# EAGLE schematic tetris_mega_5 (EAGLE 6.2)
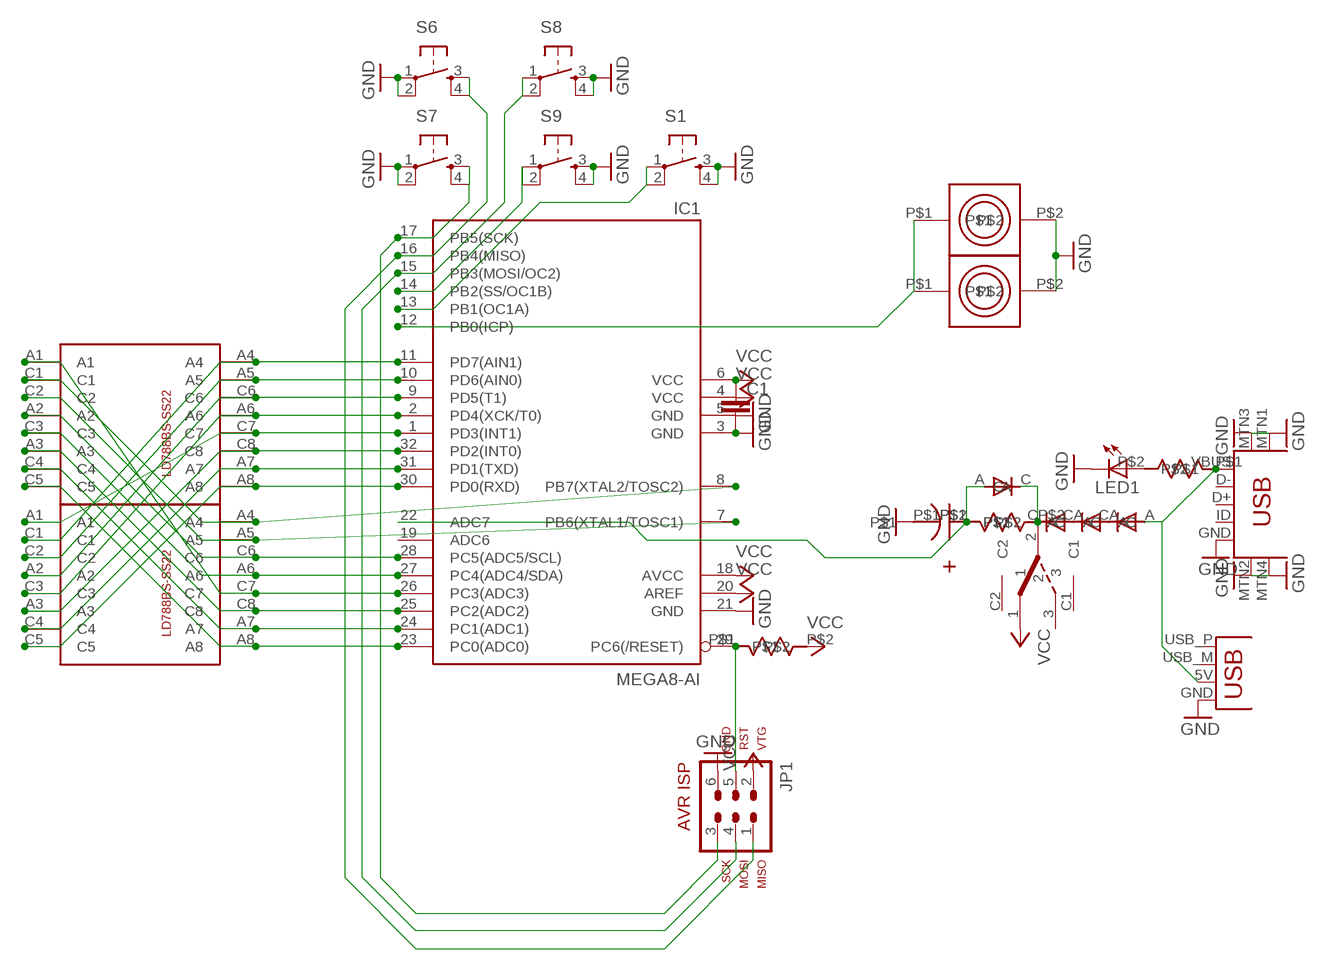
[diagram p0: schematic, sheet 1]

## Parts
C1  CAPPTH  [CAP-PTH-SMALL]
IC1  MEGA8-AI  [TQFP32-08]
JP1  AVR-ISP-6R  [AVR-ISP-6R]
LED1  LED3MM  [LED3MM]
S1  TAC_SWITCHPTH  [TACTILE-PTH]
S6  TAC_SWITCHPTH  [TACTILE-PTH]
S7  TAC_SWITCHPTH  [TACTILE-PTH]
S8  TAC_SWITCHPTH  [TACTILE-PTH]
S9  TAC_SWITCHPTH  [TACTILE-PTH]
U$1  LD788BS-SS22  [LD788BS-SS22]
U$2  LD788BS-SS22  [LD788BS-SS22]
U$3  PIEZO_ROUND_PTH  [PIEZO_ROUND_ENCASED_PTH]
U$4  I-80450RF  [ISK4.1K_I-80450RF_I2G]
U$5  USB-MINIB-5PIN  [USB-MINIB]
U$6  NICHICON_12F  [NICHICON_10X30]
U$7  R-6  [R-6]
U$8  D-6  [D-7.5]
U$9  D-6  [D-7.5]
U$10  D-6  [D-7.5]
U$11  R-6  [R-6]
U$12  D-6  [D-7.5]
U$15  SPST_PTH  [SWITCH2]
U$17  R-6  [R-6]
X1  USBPCB  [USB-A-PCB]

## Nets
GND: C1.2 IC1.3(GND) IC1.5(GND) IC1.21(GND) JP1.6 LED1.K(C) S1.3 S1.4 S6.1 S6.2 S7.1 S7.2 S8.3 S8.4 S9.3 S9.4 U$3.P$2 U$4.P$2 U$5.GND U$5.MTN1(MTN2) U$5.MTN2(MTN3) U$5.MTN3(MTN1) U$5.MTN4 U$6.P$1 X1.GND
N$1: IC1.23(PC0(ADC0)) U$1.A8 U$2.C5
N$2: IC1.24(PC1(ADC1)) U$1.A7 U$2.C4
N$3: IC1.25(PC2(ADC2)) U$1.C8 U$2.A3
N$4: IC1.30(PD0(RXD)) U$1.C5 U$2.A8
N$5: IC1.31(PD1(TXD)) U$1.C4 U$2.A7
N$6: IC1.32(PD2(INT0)) U$1.A3 U$2.C8
N$7: IC1.8(PB7(XTAL2/TOSC2)) U$1.A4 U$2.C1
N$8: IC1.7(PB6(XTAL1/TOSC1)) U$1.A5 U$2.C2
N$9: IC1.28(PC5(ADC5/SCL)) U$1.C6 U$2.A2
N$10: IC1.27(PC4(ADC4/SDA)) U$1.A6 U$2.C3
N$11: IC1.11(PD7(AIN1)) U$1.C1 U$2.A4
N$12: IC1.10(PD6(AIN0)) U$1.C2 U$2.A5
N$13: IC1.9(PD5(T1)) U$1.A2 U$2.C6
N$14: IC1.2(PD4(XCK/T0)) U$1.C3 U$2.A6
N$15: IC1.1(PD3(INT1)) U$1.A1 U$2.C7
N$16: IC1.26(PC3(ADC3)) U$1.C7 U$2.A1
N$17: IC1.29(PC6(/RESET)) JP1.5 U$7.P$1
N$19: U$8.C U$9.A
N$20: U$9.C U$10.A
N$21: IC1.17(PB5(SCK)) JP1.3
N$22: IC1.14(PB2(SS/OC1B))
N$23: IC1.16(PB4(MISO)) JP1.1 S6.3 S6.4
N$24: U$5.VBUS U$8.A U$17.P$1 X1.5V(VBUS)
N$25: S9.1 S9.2
N$26: S7.3 S7.4
N$27: IC1.13(PB1(OC1A)) S1.1 S1.2
N$28: IC1.12(PB0(ICP)) U$3.P$1 U$4.P$1
N$30: U$10.C U$11.P$2 U$12.C U$15.2
N$31: IC1.22(ADC7) U$6.P$2 U$11.P$1 U$12.A
N$34: LED1.A U$17.P$2
N$35: IC1.15(PB3(MOSI/OC2)) JP1.4 S8.1 S8.2
VCC: C1.1 IC1.4(VCC) IC1.6(VCC) IC1.18(AVCC) IC1.20(AREF) JP1.2 U$7.P$2 U$15.1
Unconnected: IC1.19(ADC6) U$5.D+ U$5.D- U$5.ID U$15.3 U$15.C1 U$15.C2 X1.USB_M(D-) X1.USB_P(D+)

## Library data of the parts
C1 = SparkFun:CAP: Capacitor Standard 0603 ceramic capacitor, and 0.1" leaded capacitor.
IC1 = atmel:MEGA8: MICROCONTROLLER 8 Kbytes FLASH, 1 kbytes SRAM, 512 bytes EEPROM, USART, 6-channel 10 bit ADC, 2-channel 8 bit ADC Pin compatible with Atmega48, ATMega88, ATMega168 Source: avr.lbr
JP1 = avr-5-4.16:AVR-ISP-6: AVR ISP-6 Serial Programming Header
LED1 = led:LED: LED OSRAM: - CHIPLED LG R971, LG N971, LY N971, LG Q971, LY Q971, LO R971, LY R971 LH N974, LH R974 LS Q976, LO Q976, LY Q976 LO Q996 - Hyper CHIPLED LW Q18S LB Q993, LB Q99A, LB R99A - SideLED LS A670, LO A670, LY A670, LG A670, LP A670 LB A673, LV A673, LT A673, LW A673 LH A674 LY A675 LS A676, LA A676, LO A676, LY A676, LW A676 LS A679, LY A679, LG A679 - Hyper Micro SIDELED® LS Y876, LA Y876, LO Y876, LY Y876 LT Y87S - SmartLED LW L88C, LW L88S LB L89C, LB L89S, LG L890 LS L89K, LO L89K, LY L89K LS L896, LA L896, LO L896, LY L896 - TOPLED LS T670, LO T670, LY T670, LG T670, LP T670 LSG T670, LSP T670, LSY T670, LOP T670, LYG T670 LG T671, LOG T671, LSG T671 LB T673, LV T673, LT T673, LW T673 LH T674 LS T676, LA T676, LO T676, LY T676, LB T676, LH T676, LSB T676, LW T676 LB T67C, LV T67C, LT T67C, LS T67K, LO T67K, LY T67K, LW E67C LS E67B, LA E67B, LO E67B, LY E67B, LB E67C, LV E67C, LT E67C LW T67C LS T679, LY T679, LG T679 LS T770, LO T770, LY T770, LG T770, LP T770 LB T773, LV T773, LT T773, LW T773 LH T774 LS E675, LA E675, LY E675, LS T675 LS T776, LA T776, LO T776, LY T776, LB T776 LHGB T686 LT T68C, LB T68C - Hyper Mini TOPLED® LB M676 - Mini TOPLED Santana® LG M470 LS M47K, LO M47K, LY M47K Source: http://www.osram.convergy.de LUXEON: - LUMILED® LXK2-PW12-R00, LXK2-PW12-S00, LXK2-PW14-U00, LXK2-PW14-V00 LXK2-PM12-R00, LXK2-PM12-S00, LXK2-PM14-U00 LXK2-PE12-Q00, LXK2-PE12-R00, LXK2-PE12-S00, LXK2-PE14-T00, LXK2-PE14-U00 LXK2-PB12-K00, LXK2-PB12-L00, LXK2-PB12-M00, LXK2-PB14-N00, LXK2-PB14-P00, LXK2-PB14-Q00 LXK2-PR12-L00, LXK2-PR12-M00, LXK2-PR14-Q00, LXK2-PR14-R00 LXK2-PD12-Q00, LXK2-PD12-R00, LXK2-PD12-S00 LXK2-PH12-R00, LXK2-PH12-S00 LXK2-PL12-P00, LXK2-PL12-Q00, LXK2-PL12-R00 Source: www.luxeon.com KINGBRIGHT: KA-3528ASYC Source: www.kingbright.com
S1 S6-S9 = SparkFun:TAC_SWITCH: Momentary Switch Button commonly used for reset or general input. Spark Fun Electronics SKU : COM-00097
U$1 U$2 = mrule:LD788BS-SS22
U$3 = mrule:PIEZO_ROUND_PTH
U$4 = mrule:I-80450RF
U$5 = SparkFun:USB-MINIB: Mini-USB "B" connector with 5th pin broken out. Created new symbol breaking out 5th "ID" pin in mini/micro USB connector spec. See: http://en.wikipedia.org/wiki/Mini_usb#Cables. Uses same footprint as 4-pin symbol. Also added pins to connect to mounting / shield pads if required (probably not generally needed as signals aren't shielded once they leave the connector).
U$6 = mrule:NICHICON_12F
U$7 U$11 U$17 = mrule:R-6
U$8-U$10 U$12 = mrule:D-6
U$15 = mrule:SPST_PTH
X1 = SparkFun:USB: USB Connectors USB-B-PTH is fully proven SKU : PRT-00139 USB-miniB is fully proven SKU : PRT-00587 USB-A-PCB is untested. USB-A-H is throughly reviewed, but untested. Spark Fun Electronics SKU : PRT-00437 USB-B-SMT is throughly reviewed, but untested. Needs silkscreen touching up. USB-A-S has not been used/tested USB-MB-H has not been used/tested